# EAGLE schematic pool-monitor (EAGLE 9.5.2)
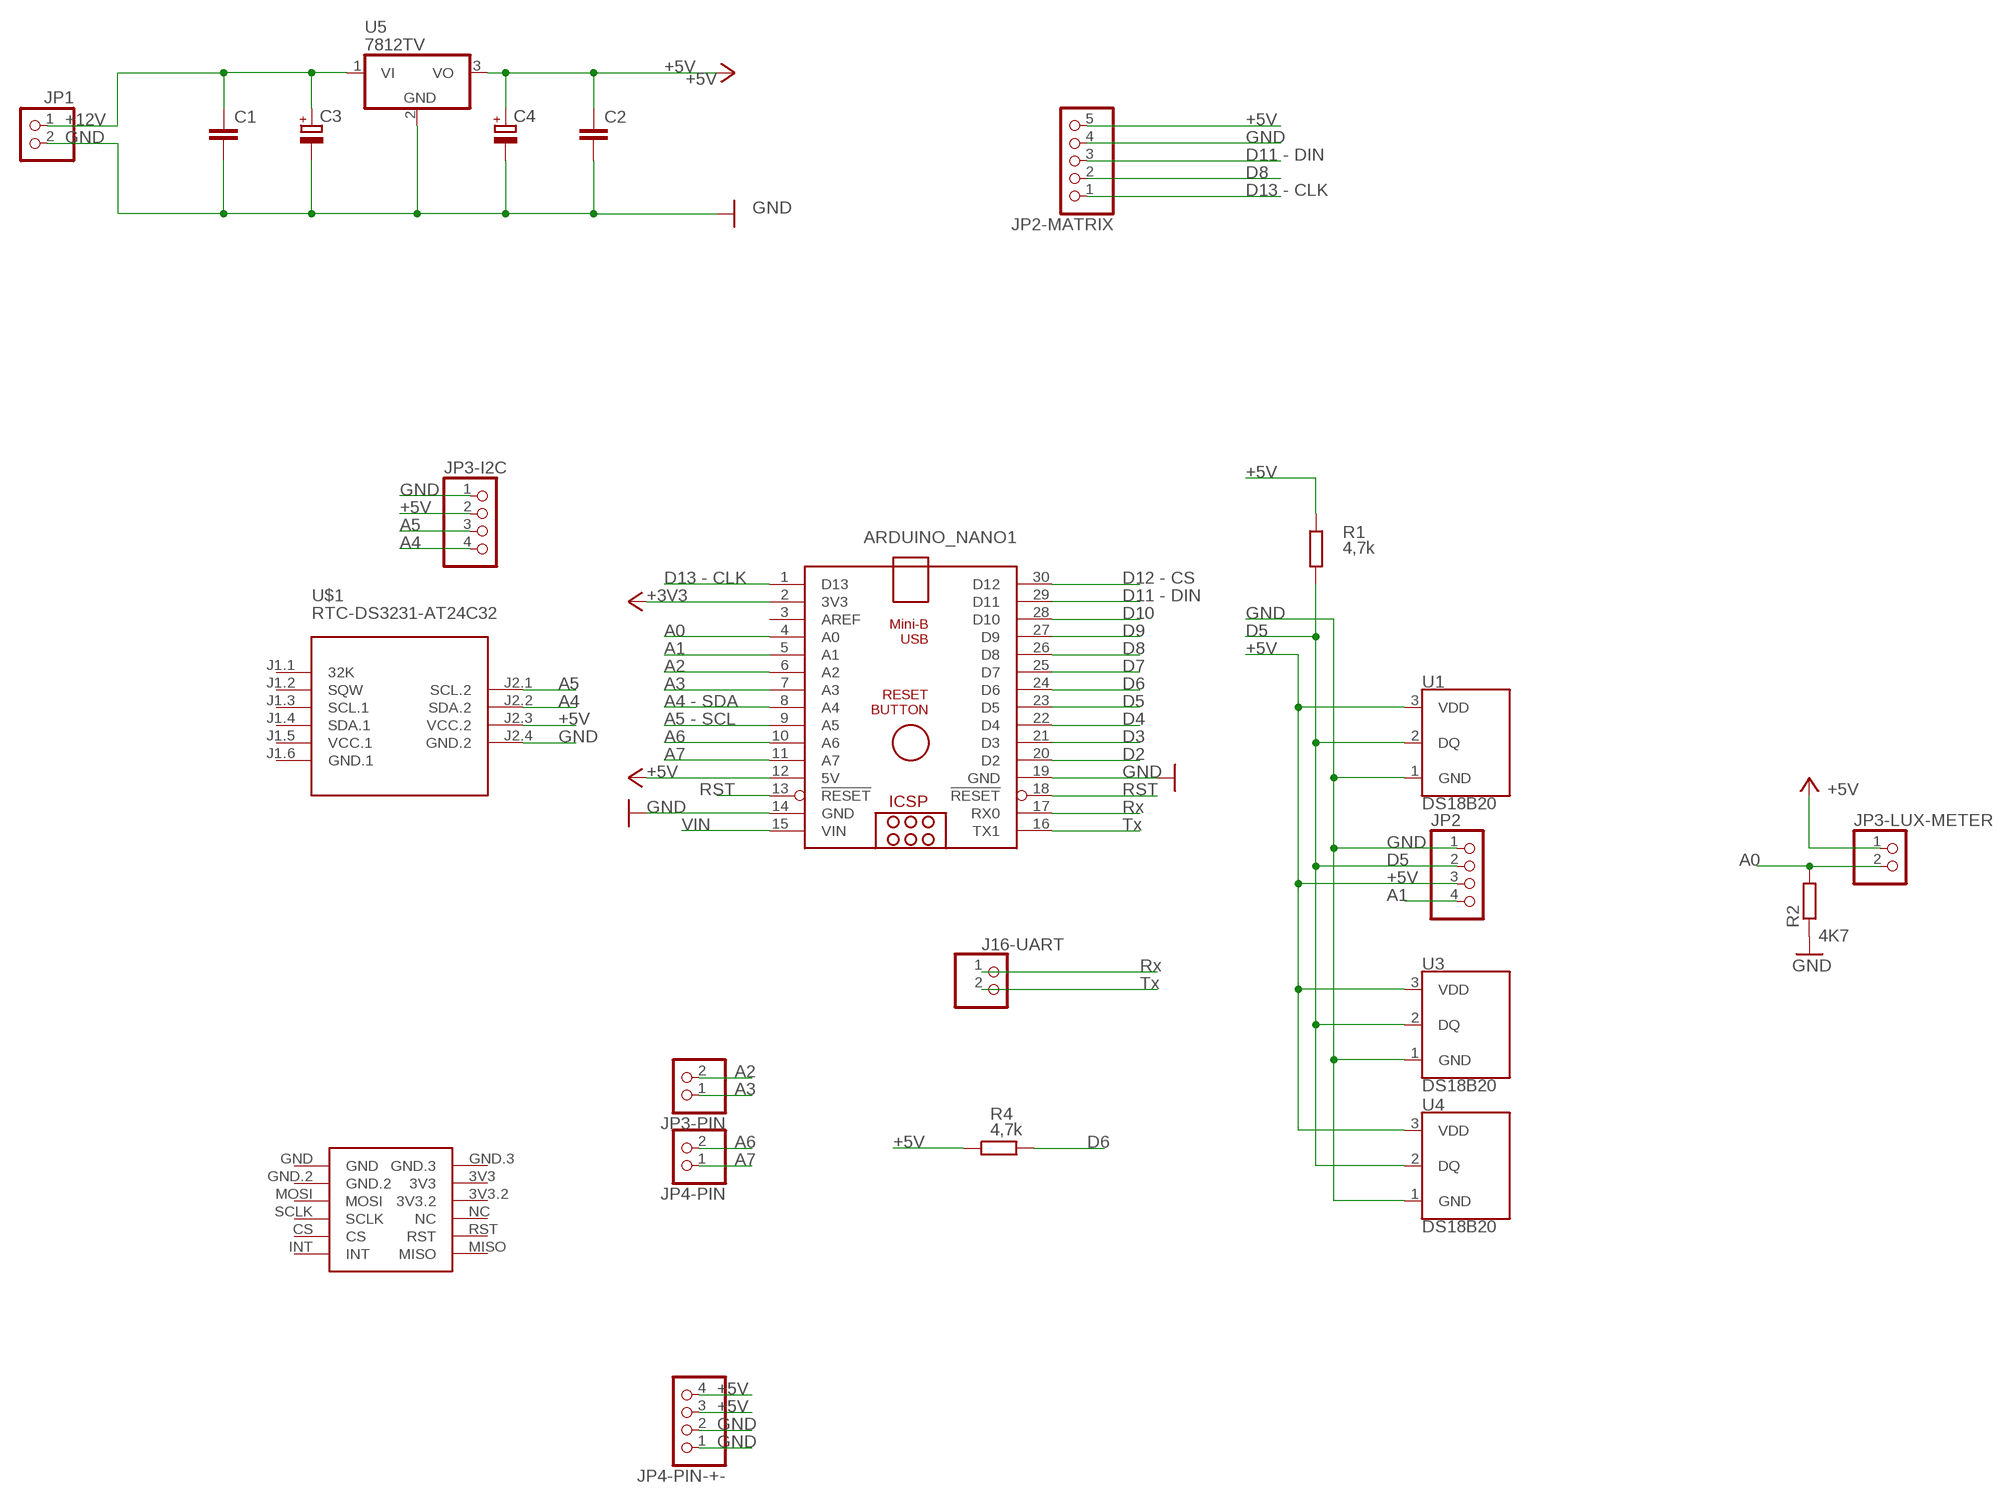
[diagram p0: schematic, sheet 1]

## Parts
ARDUINO_NANO1  ARDUINO_NANO  [ARDUINO_NANO]
C1  C-EU025-025X050  [C025-025X050]
C2  C-EU025-025X050  [C025-025X050]
C3  CPOL-EUE2-5  [E2-5]
C4  CPOL-EUE2-5  [E2-5]
J16-UART  PINHD-1X2  [1X02]
JP1  PINHD-1X2  [1X02]
JP2  PINHD-1X4  [1X04]
JP2-MATRIX  PINHD-1X5  [1X05]
JP3-I2C  PINHD-1X4  [1X04]
JP3-LUX-METER  PINHD-1X2  [1X02]
JP3-PIN  PINHD-1X2  [1X02]
JP4-PIN  PINHD-1X2  [1X02]
JP4-PIN-+-  PINHD-1X4  [1X04]
R1  4,7k  R-EU_0204/7  [0204/7]
R2  4K7  R-EU_0207/10  [0207/10]
R4  4,7k  R-EU_0204/7  [0204/7]
U1  DS18B20  [TO-92-AMMO]
U3  DS18B20  [TO-92-AMMO]
U4  DS18B20  [TO-92-AMMO]
U5  7812TV  [TO220V]
U$1  RTC-DS3231-AT24C32  [RTC-DS3231-AT24C32]
U$2  MINI_W5500  [MINI_W5500]

## Nets
+3V3: ARDUINO_NANO1.2(3V3)
+5V: ARDUINO_NANO1.12(5V) C2.1 C4.+ JP2-MATRIX.5 JP2.3 JP3-I2C.2 JP3-LUX-METER.1 JP4-PIN-+-.3 JP4-PIN-+-.4 R1.1 R4.1 U1.3(VDD) U3.3(VDD) U4.3(VDD) U5.3(VO) U$1.J2.3(VCC.2)
+12V: C1.1 C3.+ JP1.1 U5.1(VI)
A0: ARDUINO_NANO1.4(A0) JP3-LUX-METER.2 R2.2
A1: ARDUINO_NANO1.5(A1) JP2.4
A2: ARDUINO_NANO1.6(A2) JP3-PIN.2
A3: ARDUINO_NANO1.7(A3) JP3-PIN.1
A4: ARDUINO_NANO1.8(A4) JP3-I2C.4 U$1.J2.2(SDA.2)
A5: ARDUINO_NANO1.9(A5) JP3-I2C.3 U$1.J2.1(SCL.2)
A6: ARDUINO_NANO1.10(A6) JP4-PIN.2
A7: ARDUINO_NANO1.11(A7) JP4-PIN.1
D2: ARDUINO_NANO1.20(D2)
D3: ARDUINO_NANO1.21(D3)
D4: ARDUINO_NANO1.22(D4)
D5: ARDUINO_NANO1.23(D5) JP2.2 R1.2 U1.2(DQ) U3.2(DQ) U4.2(DQ)
D6: ARDUINO_NANO1.24(D6) R4.2
D7: ARDUINO_NANO1.25(D7)
D8: ARDUINO_NANO1.26(D8) JP2-MATRIX.2
D9: ARDUINO_NANO1.27(D9)
D10: ARDUINO_NANO1.28(D10)
D11: ARDUINO_NANO1.29(D11) JP2-MATRIX.3
D12: ARDUINO_NANO1.30(D12)
D13: ARDUINO_NANO1.1(D13) JP2-MATRIX.1
GND: ARDUINO_NANO1.14(GND) ARDUINO_NANO1.19(GND) C1.2 C2.2 C3.- C4.- JP1.2 JP2-MATRIX.4 JP2.1 JP3-I2C.1 JP4-PIN-+-.1 JP4-PIN-+-.2 R2.1 U1.1(GND) U3.1(GND) U4.1(GND) U5.2(GND) U$1.J2.4(GND.2)
RST: ARDUINO_NANO1.13(!RESET) ARDUINO_NANO1.18(!RESET)
RX: ARDUINO_NANO1.17(RX0) J16-UART.1
TX: ARDUINO_NANO1.16(TX1) J16-UART.2
VIN: ARDUINO_NANO1.15(VIN)
Unconnected: ARDUINO_NANO1.3(AREF) U$1.J1.1(32K) U$1.J1.2(SQW) U$1.J1.3(SCL.1) U$1.J1.4(SDA.1) U$2.3V3 U$2.3V3.2 U$2.CS U$2.GND U$2.GND.2 U$2.GND.3 U$2.INT U$2.MISO U$2.MOSI U$2.NC U$2.RST U$2.SCLK

## Notes on the sheet
- +5V
- GND
- D11 - DIN
- D13 - CLK
- +5V
- D13 - CLK | D12 - CS
- D11 - DIN
- D10 | GND
- A0 | D9 | D5
- A1 | D8 | +5V
- A2 | D7
- A3 | D6
- A4 - SDA | D5
- A5 - SCL | D4
- A6 | D3
- A7 | D2
- Rx
- VIN | Tx
- Rx
- Tx
- +5V | D6

## Power pins joined to a net without a drawn wire
GND.1: U$1.J1.6(GND.1)
VCC.1: U$1.J1.5(VCC.1)

## Library data of the parts
ARDUINO_NANO1 = ArduinoNanoV30:ARDUINO_NANO: Arduino Nano V3.0 Overview: The Arduino Nano is a small, complete, and breadboard-friendly board based on the ATmega328 (Arduino Nano 3.x) or ATmega168 (Arduino Nano 2.x). It has more or less the same functionality of the Arduino Duemilanove, but in a different package. It lacks only a DC power jack, and works with a Mini-B USB cable instead of a standard one. The Nano was designed and is being produced by Gravitech. Specifications: Microcontroller Atmel ATmega168 or ATmega328 Operating Voltage (logic level) 5 V Input Voltage (recommended) 7-12 V Input Voltage (limits) 6-20 V Digital I/O Pins 14 (of which 6 provide PWM output) Analog Input Pins 8 DC Current per I/O Pin 40 mA Flash Memory 16 KB (ATmega168) or 32 KB (ATmega328) of which 2 KB used by bootloader SRAM 1 KB (ATmega168) or 2 KB (ATmega328) EEPROM 512 bytes (ATmega168) or 1 KB (ATmega328) Clock Speed 16 MHz Dimensions 0.73" x 1.70" Length 45 mm Width 18 mm Weigth 5 g Power: The Arduino Nano can be powered via the Mini-B USB connection, 6-20V unregulated external power supply (pin 30), or 5V regulated external power supply (pin 27). The power source is automatically selected to the highest voltage source. Memory: The ATmega168 has 16 KB of flash memory for storing code (of which 2 KB is used for the bootloader); the ATmega328 has 32 KB, (also with 2 KB used for the bootloader). The ATmega168 has 1 KB of SRAM and 512 bytes of EEPROM (which can be read and written with the EEPROM library); the ATmega328 has 2 KB of SRAM and 1 KB of EEPROM. Input and Output: Each of the 14 digital pins on the Nano can be used as an input or output, using pinMode(), digitalWrite(), and digitalRead() functions. They operate at 5 volts. Each pin can provide or receive a maximum of 40 mA and has an internal pull-up resistor (disconnected by default) of 20-50 kOhms. In addition, some pins have specialized functions. Visit Arduino - ArduinoBoardNano <https://www.arduino.cc/en/Main/ArduinoBoardNano>
C1 C2 = rcl:C-EU: CAPACITOR, European symbol
C3 C4 = rcl:CPOL-EU: POLARIZED CAPACITOR, European symbol
J16-UART JP1 JP3-LUX-METER JP3-PIN JP4-PIN = pinhead:PINHD-1X2: PIN HEADER
JP2 JP3-I2C JP4-PIN-+- = pinhead:PINHD-1X4: PIN HEADER
JP2-MATRIX = pinhead:PINHD-1X5: PIN HEADER
R1 R4 = rcl:R-EU_: RESISTOR, European symbol
R2 = rcl:R-EU_: RESISTOR, European symbol; SPICEPREFIX: R
U1 U3 U4 = SparkFun-Sensors:DS18B20: Dallas/Maxim DS18B20 1-Wire Temperature Sensor The DS18B20 reports degrees C with 9 to 12-bit precision, -55C to 125C (+/-0.5C). Each sensor has a unique 64-Bit Serial number etched into it - allows for a huge number of sensors to be used on one data bus. Datasheet <http://datasheets.maximintegrated.com/en/ds/DS18B20.pdf> SparkFun Products One Wire Digital Temperature Sensor - DS18B20 <https://www.sparkfun.com/products/245> (SEN-00245); STORE_ID: SEN-00245
U5 = linear:78*: Positive VOLTAGE REGULATOR Source: http://cache.national.com/ds/LM/LM78L05.pdf http://www.fairchildsemi.com/ds/LM/LM7805.pdf
U$1 = diy-modules:RTC-DS3231-AT24C32: RTC Module with Battery and EEPROM based on DS3231 and AT24C32 chips Tutorial can be found here: https://edwardmallon.wordpress.com/2014/05/21/using-a-cheap-3-ds3231-rtc-at24c32-eeprom-from-ebay/ Click here to find device on ebay.com <http://www.ebay.com/sch/DS3231+AT24C32+module>
U$2 = ethernet-mikroavr:MINI_W5500: MINI ETHERNET W5500, CREATE BY MIKROAVR.COM